# Altium project IPG.PrjPcb (part 4 of 13)

## Sheet 09-IMC.SchDoc: Impedance Measurement Circuit
size A2; DocumentNumber: 9; SheetNumber: 9; SheetTotal: 15
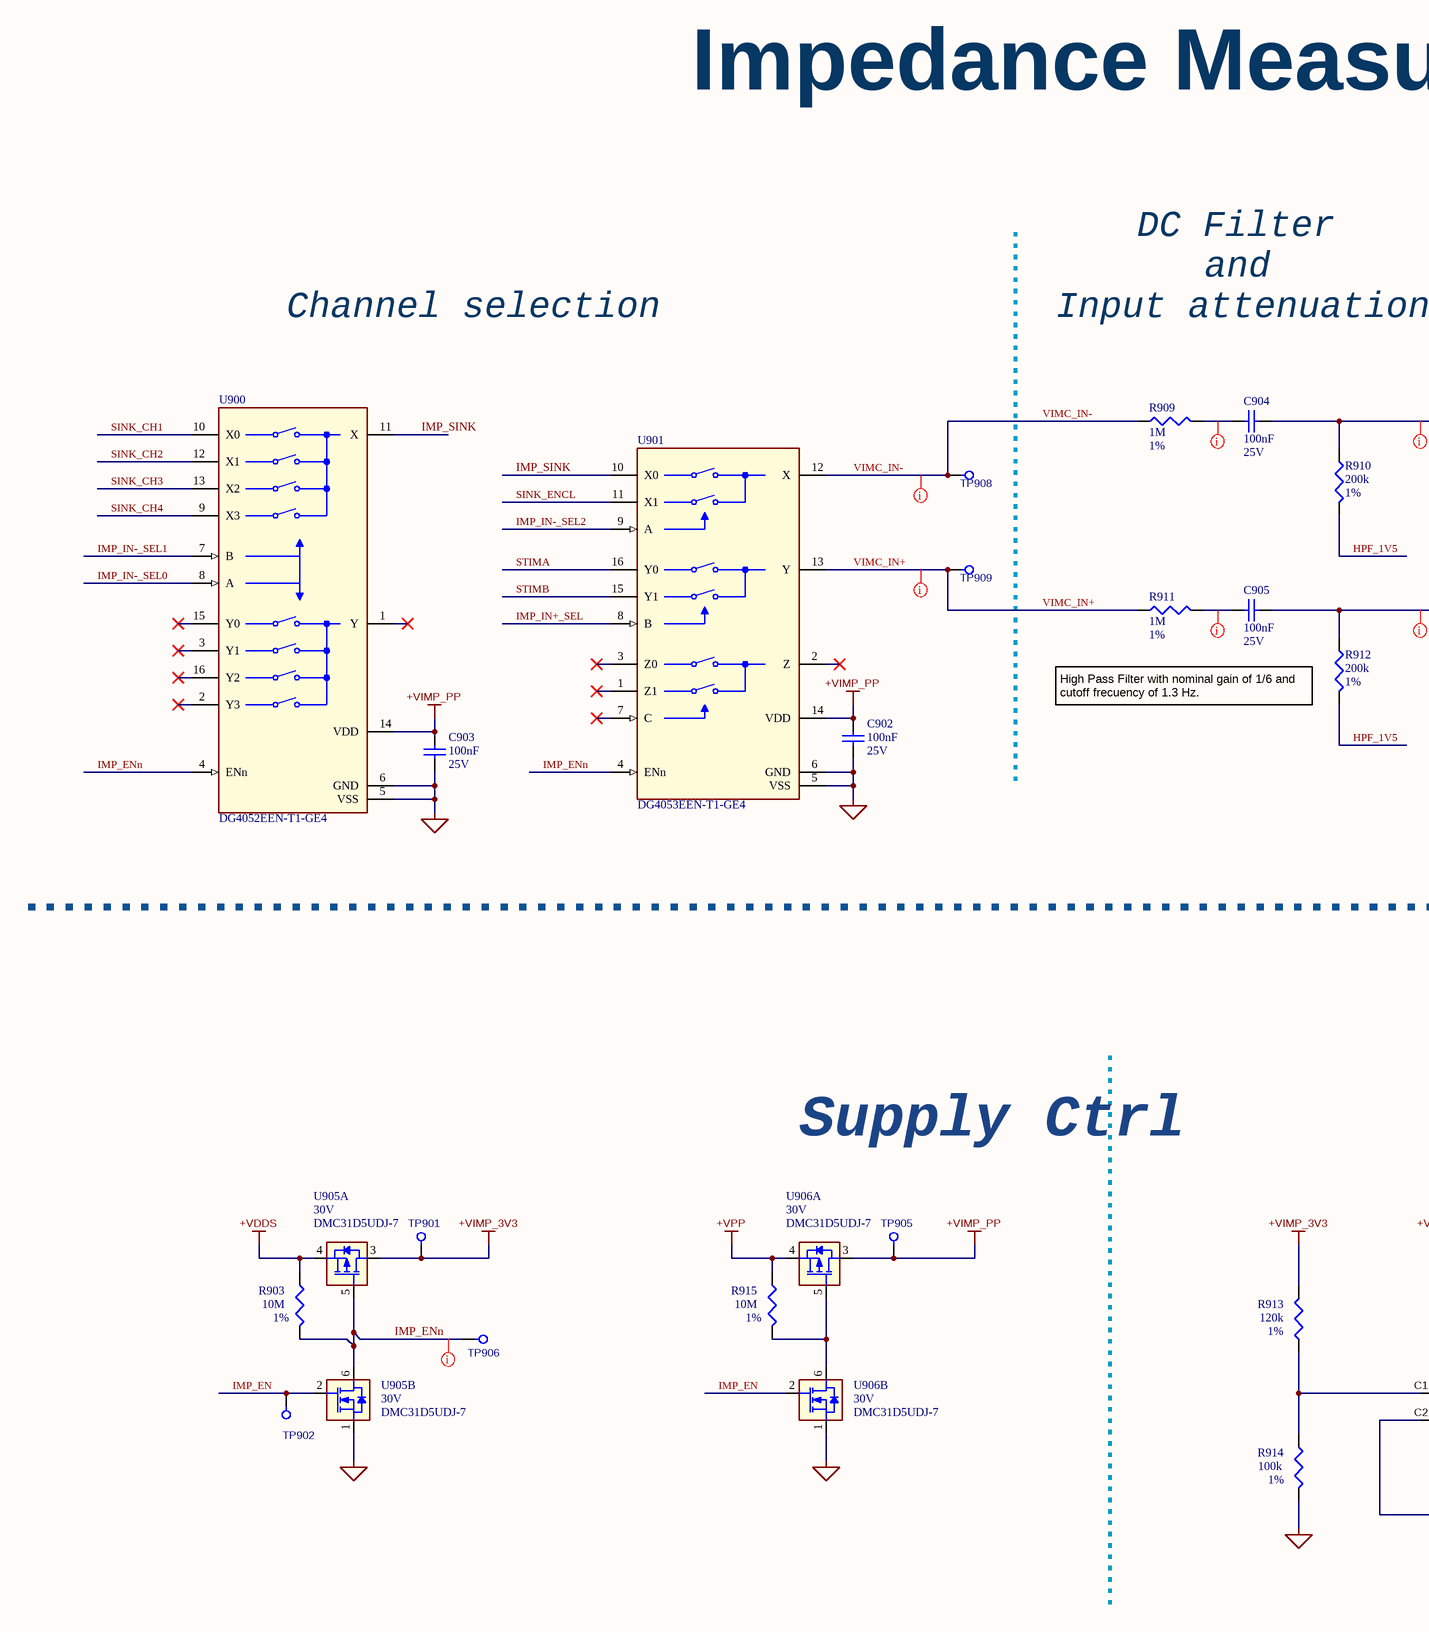
[diagram p12: 09-IMC.SchDoc, left]
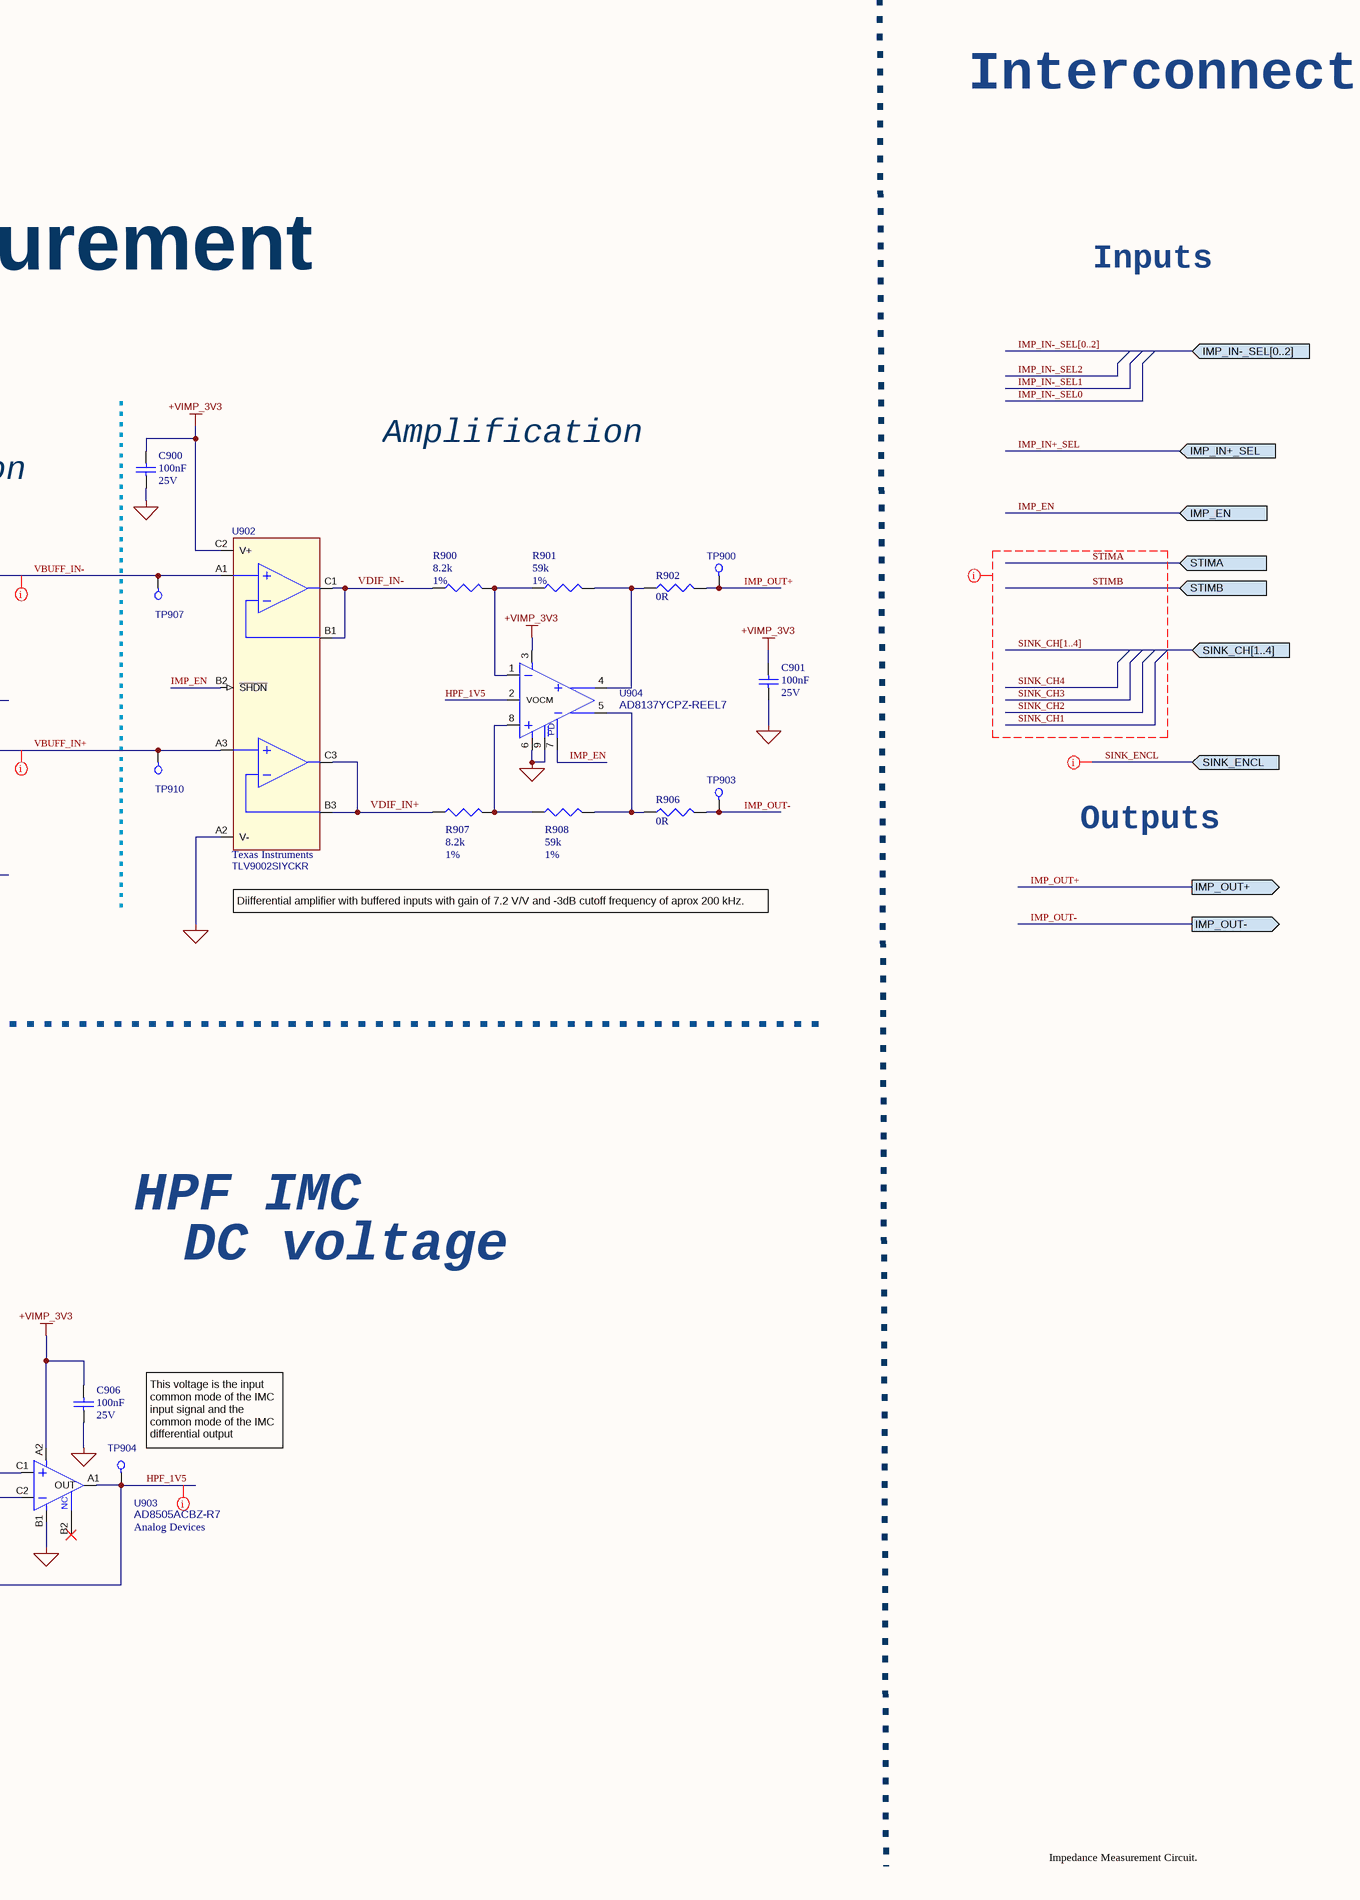
[diagram p13: 09-IMC.SchDoc, right]

### Parts
C900  value 100nF  Rated DC Voltage (URdc): 25V  [C0201_C]  (hidden comment: GRM033R61E104KE14J)
C901  value 100nF  Rated DC Voltage (URdc): 25V  [C0201_C]  (hidden comment: GRM033R61E104KE14J)
C902  value 100nF  Rated DC Voltage (URdc): 25V  [C0201_C]  (hidden comment: GRM033R61E104KE14J)
C903  value 100nF  Rated DC Voltage (URdc): 25V  [C0201_C]  (hidden comment: GRM033R61E104KE14J)
C904  value 100nF  Rated DC Voltage (URdc): 25V  [C0201_C]  (hidden comment: GRM033R61E104KE14J)
C905  value 100nF  Rated DC Voltage (URdc): 25V  [C0201_C]  (hidden comment: GRM033R61E104KE14J)
C906  value 100nF  Rated DC Voltage (URdc): 25V  [C0201_C]  (hidden comment: GRM033R61E104KE14J)
R900  value 8.2k  Tolerance: 1%  [R0201_C]  (hidden comment: CRCW02018K20FNED)
R901  value 59k  Tolerance: 1%  [R0201_C]  (hidden comment: CRCW020159K0FNED)
R902  value 0R  [R0201_C]  (hidden comment: CRCW02010000Z0ED)
R903  value 10M  Tolerance: 1%  [R0201_C]  (hidden comment: CRCW020110M0FNED)
R906  value 0R  [R0201_C]  (hidden comment: CRCW02010000Z0ED)
R907  value 8.2k  Tolerance: 1%  [R0201_C]  (hidden comment: CRCW02018K20FNED)
R908  value 59k  Tolerance: 1%  [R0201_C]  (hidden comment: CRCW020159K0FNED)
R909  value 1M  Tolerance: 1%  [R0201_C]  (hidden comment: CRCW02011M00FNED)
R910  value 200k  Tolerance: 1%  [R0201_C]  (hidden comment: CRCW0201200KFNED)
R911  value 1M  Tolerance: 1%  [R0201_C]  (hidden comment: CRCW02011M00FNED)
R912  value 200k  Tolerance: 1%  [R0201_C]  (hidden comment: CRCW0201200KFNED)
R913  value 120k  Tolerance: 1%  [R0201_C]  (hidden comment: CRCW0201120KFNED)
R914  value 100k  Tolerance: 1%  [R0201_C]  (hidden comment: CRCW0201100KFNED)
R915  value 10M  Tolerance: 1%  [R0201_C]  (hidden comment: CRCW020110M0FNED)
TP900  Test Point  [testpad_0.9mm]  (value not drawn)  (no BOM)
TP901  Test Point  [testpad_0.9mm]  (value not drawn)  (no BOM)
TP902  Test Point  [testpad_0.9mm]  (value not drawn)  (no BOM)
TP903  Test Point  [testpad_0.9mm]  (value not drawn)  (no BOM)
TP904  Test Point  [testpad_0.9mm]  (value not drawn)  (no BOM)
TP905  Test Point  [testpad_0.9mm]  (value not drawn)  (no BOM)
TP906  Test Point  [testpad_0.9mm]  (value not drawn)  (no BOM)
TP907  Test Point  [testpad_0.9mm]  (value not drawn)  (no BOM)
TP908  Test Point  [testpad_0.9mm]  (value not drawn)  (no BOM)
TP909  Test Point  [testpad_0.9mm]  (value not drawn)  (no BOM)
TP910  Test Point  [testpad_0.9mm]  (value not drawn)  (no BOM)
U900  DG4052EEN-T1-GE4  [QFN40P180X260X60-16N-D]
U901  DG4053EEN-T1-GE4  [QFN40P180X260X60-16N-D]
U902  Manufacturer: Texas Instruments  [TI_YCK0009]  (hidden comment: TLV9002SIYCKR)
U903  Manufacturer: Analog Devices  [AD8505ACBZ-R7]  (hidden comment: AD8505ACBZ-R7)
U904  AD8137YCPZ-REEL7  [AD_CP-8-13]
U905  DMC31D5UDJ-7  Vds(Max): 30V  [DIODESINC_SOT-963-6]  (parts A,B of 2)
U906  DMC31D5UDJ-7  Vds(Max): 30V  [DIODESINC_SOT-963-6]  (parts A,B of 2)

### Ports
IMP_EN (in), IMP_IN+_SEL (in), IMP_IN-_SEL[0..2] (in), IMP_OUT+ (out), IMP_OUT- (out), SINK_CH[1..4] (in), SINK_ENCL (in), STIMA (in), STIMB (in)

### Nets
+VDDS: R903.1 U905.4
+VIMP_3V3: C900.2 C901.2 C906.2 R913.2 TP901.1 U902.C2(V+) U903.A2(V+) U904.3(VS+) U905.3
+VIMP_PP: C902.2 C903.2 TP905.1 U900.14(VDD) U901.14(VDD) U906.3
+VPP: R915.1 U906.4
GND: C900.1 C901.1 C902.1 C903.1 C906.1 R914.2 U900.5(VSS) U900.6(GND) U901.5(VSS) U901.6(GND) U902.A2(V-) U903.B1(V-) U904.6(VS-) U904.9(EP) U905.1 U906.1
HPF_1V5: R910.1 R912.1 TP904.1 U903.A1(OUT) U903.C2(IN-) U904.2(VOCM)
IMP_EN: TP902.1 U902.B2(~{SHDN}) U904.7(~{PD}) U905.2 U906.2 ; port IMP_EN
IMP_ENn: R903.2 TP906.1 U900.4(ENn) U901.4(ENn) U905.5 U905.6
IMP_IN+_SEL: U901.8(B) ; port IMP_IN+_SEL
IMP_IN-_SEL0: U900.8(A)
IMP_IN-_SEL1: U900.7(B)
IMP_IN-_SEL2: U901.9(A)
IMP_OUT+: R902.2 TP900.1 ; port IMP_OUT+
IMP_OUT-: R906.2 TP903.1 ; port IMP_OUT-
IMP_SINK: U900.11(X) U901.10(X0)
SINK_CH1: U900.10(X0)
SINK_CH2: U900.12(X1)
SINK_CH3: U900.13(X2)
SINK_CH4: U900.9(X3)
SINK_ENCL: U901.11(X1) ; port SINK_ENCL
STIMA: U901.16(Y0) ; port STIMA
STIMB: U901.15(Y1) ; port STIMB
VBUFF_IN+: C905.1 R912.2 TP910.1 U902.A3(IN2+)
VBUFF_IN-: C904.1 R910.2 TP907.1 U902.A1(IN1+)
VDIF_IN+: R907.1 U902.B3(IN2-) U902.C3(OUT2)
VDIF_IN-: R900.1 U902.B1(IN1-) U902.C1(OUT1)
VIMC_IN+: R911.2 TP909.1 U901.13(Y)
VIMC_IN-: R909.2 TP908.1 U901.12(X)
NetC904_2: C904.2 R909.1
NetC905_2: C905.2 R911.1
NetR900_2: R900.2 R901.1 U904.1(-IN)
NetR901_2: R901.2 R902.1 U904.4(+OUT)
NetR906_1: R906.1 R908.2 U904.5(-OUT)
NetR907_2: R907.2 R908.1 U904.8(+IN)
NetR913_1: R913.1 R914.1 U903.C1(IN+)
NetR915_2: R915.2 U906.5 U906.6

Not connected (* = marked no-connect by the designer): U900 1(Y)* 2(Y3)* 3(Y1)* 15(Y0)* 16(Y2)*; U901 1(Z1)* 2(Z)* 3(Z0)* 7(C)*; U903 B2(NC)*

### Buses and harness runs
bus IMP_IN-_SEL[0..2] = port IMP_IN-_SEL[0..2]
bus SINK_CH[1..4] = port SINK_CH[1..4]

### Layout directives
net class ANALOG: HPF_1V5, NetC904_2, NetC905_2, SINK_CH1, SINK_CH2, SINK_CH3, SINK_CH4, SINK_CH[1..4], SINK_ENCL, STIMA, STIMB, VBUFF_IN+, VBUFF_IN-, VIMC_IN+, VIMC_IN-
net class DIGITAL: IMP_ENn

### Notes on the sheet
- Interconnect
- Impedance Measurement
- Inputs
- DC Filter
- Channel selection
- Input attenuation
- and
- Amplification
- (near R912) High Pass Filter with nominal gain of 1/6 and cutoff frecuency of 1.3 Hz.
- Outputs
- Diifferential amplifier with buffered inputs with gain of 7.2 V/V and -3dB cutoff frequency of aprox 200 kHz.
- Supply Ctrl
- HPF IMC
- DC voltage
- (near TP904) This voltage is the input common mode of the IMC input signal and the common mode of the IMC differential output
- Impedance Measurement Circuit.
- Project:
- Schematic:
- Design by:
- Date:
- Ver:
- .
- Comments:
- Reviewed by:
- (in symbol AD8137YCPZ-REEL7) PD

### Library data of the parts
C900-C906 = GRM033R61E104KE14J: Ceramic Capacitor, Multilayer, Ceramic, 25V, 10% +Tol, 10% -Tol, X5R, 15% TC, 0.1uF, Surface Mount, 0201; Manufacturer: Murata; Multilayer: Yes; Category: Ceramic Capacitors; Supplier: Digikey; Supplier Part Number: 490-14571-1-ND; Manufacturer Part Number: GRM033R61E104KE14J; RoHS: Yes; Stock: 1540851; Pricing: 1=0,1, 10=0,033, 50=0,0192, 100=0,0148, 500=0,01118, 1000=0,00878, 2500=0,00798, 5000=0,00734 (USD); Mounting Technology: Surface Mount; Pins: 2; Dielectric Material: Ceramic; Package Shape: Rectangular; Case/Package: 0201; Terminal Finish: Nickel; Min Operating Temperature: -55°C; Max Operating Temperature: 85°C; JESD-609 Code: e3; Capacitor Type: Ceramic; Tolerance  (fill in as +-): 10%; Package Style: SMTMeter; Packaging: Tape and Reel; Tolerance (fill in as +-): 10%; Temperature Characteristics Code: X5R; Termination: Wraparound; Length: 0.6mm; Width: 0.3mm; Height: 0.3mm; Reach SVHC Compliant: Yes; RoHS Compliant: Yes; ComponentLink1URL: https://psearch.en.murata.com:443/capacitor/product/GRM033R61E104KE14%23.pdf?src-supplier=IHS+Markit; ComponentLink1Description: https://psearch.en.murata.com:443/capacitor/product/GRM033R61E104KE14%23.pdf?src-supplier=IHS+Markit; ComponentLink2URL: http://www.mouser.com/ds/2/281/c02e-2905.pdf?src-supplier=Mouser; ComponentLink2Description: http://www.mouser.com/ds/2/281/c02e-2905.pdf?src-supplier=Mouser; ComponentLink3URL: http://search.murata.co.jp/Ceramy/image/img/A01X/G101/ENG/GRM033R61E104KE14-01.pdf?src-supplier=Digikey; ComponentLink3Description: http://search.murata.co.jp/Ceramy/image/img/A01X/G101/ENG/GRM033R61E104KE14-01.pdf?src-supplier=Digikey; ComponentLink4URL: https://search.murata.co.jp/Ceramy/image/img/A01X/G101/ENG/GRM033R61E104KE14-01.pdf?src-supplier=Digikey; ComponentLink4Description: https://search.murata.co.jp/Ceramy/image/img/A01X/G101/ENG/GRM033R61E104KE14-01.pdf?src-supplier=Digikey; Supplier 1: Arrow Electronics; Supplier Part Number 1: GRM033R61E104KE14J
R900 R907 = CRCW02018K20FNED: Fixed Resistor, Metal Glaze/thick Film, 0.05W, 8200ohm, 30V, 1% +/-Tol, 200ppm/Cel, Surface Mount, 0201; Manufacturer: Vishay; Medical Grade MFR: TBD; Power: 50mW; Rated Temperature: 70°C; Temperature Coefficient: 200ppm/°C; Package Height: 0.23mm; Package Length: 0.6mm; Package Width: 0.3mm; Reference Standard: AEC-Q200; Manufacturer Part Number: CRCW02018K20FNED; RoHS: Yes; Category: Chip SMD Resistors; Mounting Technology: Surface Mount; Pins: 2; Package Shape: Rectangular; Case/Package: 0201; Terminal Finish: Nickel; Min Operating Temperature: -55°C; Max Operating Temperature: 155°C; Resistor Type: FIXED RESISTOR; Construction: Chip; Package Style: SMTMeter; Technology: METAL GLAZE/THICK FILM; Termination: Wraparound; Working Voltage: 30V; Reach SVHC Compliant: Yes; RoHS Compliant: Yes; ComponentLink1URL: https://datasheet.ciiva.com:443/pdfs/VipMasterIC/IC/VISH/VISH-S-A0002932828/VISH-S-A0002932828-1.pdf?src-supplier=IHS+Markit; ComponentLink1Description: https://datasheet.ciiva.com:443/pdfs/VipMasterIC/IC/VISH/VISH-S-A0002932828/VISH-S-A0002932828-1.pdf?src-supplier=IHS+Markit; ComponentLink2URL: https://datasheet.ciiva.com/7983/1719906-7983324.pdf?src-supplier=Element14; ComponentLink2Description: https://datasheet.ciiva.com/7983/1719906-7983324.pdf?src-supplier=Element14; ComponentLink3URL: https://datasheet.ciiva.com/7983/1719906-7983323.pdf?src-supplier=Element14; ComponentLink3Description: https://datasheet.ciiva.com/7983/1719906-7983323.pdf?src-supplier=Element14; ComponentLink4URL: https://datasheet.ciiva.com/22692/1719906-22692751.pdf?src-supplier=Element14; ComponentLink4Description: https://datasheet.ciiva.com/22692/1719906-22692751.pdf?src-supplier=Element14; ComponentLink5URL: https://datasheet.ciiva.com/22665/1825492-22665818.pdf?src-supplier=Element14; ComponentLink5Description: https://datasheet.ciiva.com/22665/1825492-22665818.pdf?src-supplier=Element14; ComponentLink6URL: https://datasheet.ciiva.com/2474/crcw0201e3-2474801.pdf?src-supplier=Digikey; ComponentLink6Description: https://datasheet.ciiva.com/2474/crcw0201e3-2474801.pdf?src-supplier=Digikey; ComponentLink7URL: https://datasheet.ciiva.com/2474/crcw0201e3-2474802.pdf?src-supplier=Digikey; ComponentLink7Description: https://datasheet.ciiva.com/2474/crcw0201e3-2474802.pdf?src-supplier=Digikey; ComponentLink8URL: https://datasheet.ciiva.com/2474/crcw0201e3-2474800.pdf?src-supplier=Digikey; ComponentLink8Description: https://datasheet.ciiva.com/2474/crcw0201e3-2474800.pdf?src-supplier=Digikey; ComponentLink9URL: https://datasheet.ciiva.com/22871/70202042-22871422.pdf?src-supplier=Allied+Electronics; ComponentLink9Description: https://datasheet.ciiva.com/22871/70202042-22871422.pdf?src-supplier=Allied+Electronics; ComponentLink10URL: https://datasheet.ciiva.com/3255/crcw0201e3-3255929.pdf?src-supplier=Avnet; ComponentLink10Description: https://datasheet.ciiva.com/3255/crcw0201e3-3255929.pdf?src-supplier=Avnet; Medical Grade MFR PN: TBD; Supplier 1: Digikey; Supplier Part Number 1: 541-CRCW02018K20FNEDCT-ND
R901 R908 = CRCW020159K0FNED: Fixed Resistor, Metal Glaze/thick Film, 0.05W, 59000ohm, 30V, 1% +/-Tol, 200ppm/Cel, Surface Mount, 0201; Manufacturer: Vishay; Medical Grade MFR: TBD; Power: 50mW; Rated Temperature: 70°C; Temperature Coefficient: 200ppm/°C; Package Height: 0.23mm; Package Length: 0.6mm; Package Width: 0.3mm; Reference Standard: AEC-Q200; Manufacturer Part Number: CRCW020159K0FNED; RoHS: Yes; Category: Chip SMD Resistors; Mounting Technology: Surface Mount; Pins: 2; Package Shape: Rectangular; Case/Package: 0201; Terminal Finish: Nickel; Min Operating Temperature: -55°C; Max Operating Temperature: 155°C; Resistor Type: FIXED RESISTOR; Construction: Chip; Package Style: SMTMeter; Technology: METAL GLAZE/THICK FILM; Termination: Wraparound; Working Voltage: 30V; Reach SVHC Compliant: Yes; RoHS Compliant: Yes; ComponentLink1URL: https://datasheet.ciiva.com:443/pdfs/VipMasterIC/IC/VISH/VISH-S-A0002932828/VISH-S-A0002932828-1.pdf?src-supplier=IHS+Markit; ComponentLink1Description: https://datasheet.ciiva.com:443/pdfs/VipMasterIC/IC/VISH/VISH-S-A0002932828/VISH-S-A0002932828-1.pdf?src-supplier=IHS+Markit; ComponentLink2URL: https://datasheet.ciiva.com/7983/1719906-7983324.pdf?src-supplier=Element14; ComponentLink2Description: https://datasheet.ciiva.com/7983/1719906-7983324.pdf?src-supplier=Element14; ComponentLink3URL: https://datasheet.ciiva.com/7983/1719906-7983323.pdf?src-supplier=Element14; ComponentLink3Description: https://datasheet.ciiva.com/7983/1719906-7983323.pdf?src-supplier=Element14; ComponentLink4URL: https://datasheet.ciiva.com/22692/1719906-22692751.pdf?src-supplier=Element14; ComponentLink4Description: https://datasheet.ciiva.com/22692/1719906-22692751.pdf?src-supplier=Element14; ComponentLink5URL: https://datasheet.ciiva.com/22665/1825492-22665818.pdf?src-supplier=Element14; ComponentLink5Description: https://datasheet.ciiva.com/22665/1825492-22665818.pdf?src-supplier=Element14; ComponentLink6URL: https://datasheet.ciiva.com/2474/crcw0201e3-2474801.pdf?src-supplier=Digikey; ComponentLink6Description: https://datasheet.ciiva.com/2474/crcw0201e3-2474801.pdf?src-supplier=Digikey; ComponentLink7URL: https://datasheet.ciiva.com/2474/crcw0201e3-2474802.pdf?src-supplier=Digikey; ComponentLink7Description: https://datasheet.ciiva.com/2474/crcw0201e3-2474802.pdf?src-supplier=Digikey; ComponentLink8URL: https://datasheet.ciiva.com/2474/crcw0201e3-2474800.pdf?src-supplier=Digikey; ComponentLink8Description: https://datasheet.ciiva.com/2474/crcw0201e3-2474800.pdf?src-supplier=Digikey; ComponentLink9URL: https://datasheet.ciiva.com/22871/70202042-22871422.pdf?src-supplier=Allied+Electronics; ComponentLink9Description: https://datasheet.ciiva.com/22871/70202042-22871422.pdf?src-supplier=Allied+Electronics; ComponentLink10URL: https://datasheet.ciiva.com/3255/crcw0201e3-3255929.pdf?src-supplier=Avnet; ComponentLink10Description: https://datasheet.ciiva.com/3255/crcw0201e3-3255929.pdf?src-supplier=Avnet; Medical Grade MFR PN: TBD; Supplier 1: Digikey; Supplier Part Number 1: 541-CRCW020159K0FNEDCT-ND
R902 R906 = CRCW02010000Z0ED: Fixed Resistor, Metal Glaze/thick Film, 0.05W, 0ohm, Surface Mount, 0201; Manufacturer: Vishay; Medical Grade MFR: Mini-Systems; Medical Grade MFR PN: MWA96SM-0000F-NS62TR; Power: 50mW; Rated Temperature: 70°C; Package Height: 0.23mm; Package Length: 0.6mm; Package Width: 0.3mm; Reference Standard: AEC-Q200; Category: Chip SMD Resistors; Supplier: Digikey; Supplier Part Number: 541-0.0AGCT-ND; Manufacturer Part Number: CRCW02010000Z0ED; RoHS: Yes; Stock: 701366; Pricing: 1=0,1, 10=0,034, 25=0,026, 50=0,0198, 100=0,0138, 250=0,01112, 500=0,0089, 1000=0,00655, 5000=0,0047 (USD); Mounting Technology: Surface Mount; Pins: 2; Package Shape: Rectangular; Case/Package: 0201; Terminal Finish: Nickel; Min Operating Temperature: -55°C; Max Operating Temperature: 155°C; JESD-609 Code: e3; Resistor Type: FIXED RESISTOR; Construction: Chip; Package Style: SMTMeter; Packaging: Tape and Reel; Technology: METAL GLAZE/THICK FILM; Termination: Wraparound; Reach SVHC Compliant: Yes; RoHS Compliant: Yes; ComponentLink1URL: https://datasheet.ciiva.com:443/pdfs/VipMasterIC/IC/VISH/VISH-S-A0002932828/VISH-S-A0002932828-1.pdf?src-supplier=IHS+Markit; ComponentLink1Description: https://datasheet.ciiva.com:443/pdfs/VipMasterIC/IC/VISH/VISH-S-A0002932828/VISH-S-A0002932828-1.pdf?src-supplier=IHS+Markit; ComponentLink2URL: https://datasheet.ciiva.com/2471/crcw0201e3-2471712.pdf?src-supplier=Digikey; ComponentLink2Description: https://datasheet.ciiva.com/2471/crcw0201e3-2471712.pdf?src-supplier=Digikey; ComponentLink3URL: https://datasheet.ciiva.com/7841/1719906-7841431.pdf?src-supplier=Element14; ComponentLink3Description: https://datasheet.ciiva.com/7841/1719906-7841431.pdf?src-supplier=Element14; ComponentLink4URL: https://datasheet.ciiva.com/7841/1719906-7841430.pdf?src-supplier=Element14; ComponentLink4Description: https://datasheet.ciiva.com/7841/1719906-7841430.pdf?src-supplier=Element14; ComponentLink5URL: https://datasheet.ciiva.com/22665/1847332-22665688.pdf?src-supplier=Element14; ComponentLink5Description: https://datasheet.ciiva.com/22665/1847332-22665688.pdf?src-supplier=Element14; ComponentLink6URL: https://datasheet.ciiva.com/2471/crcw0201e3-2471713.pdf?src-supplier=Digikey; ComponentLink6Description: https://datasheet.ciiva.com/2471/crcw0201e3-2471713.pdf?src-supplier=Digikey; ComponentLink7URL: https://datasheet.ciiva.com/2471/crcw0201e3-2471711.pdf?src-supplier=Digikey; ComponentLink7Description: https://datasheet.ciiva.com/2471/crcw0201e3-2471711.pdf?src-supplier=Digikey; ComponentLink8URL: https://datasheet.ciiva.com/16757/70202042-16757849.pdf?src-supplier=Allied+Electronics; ComponentLink8Description: https://datasheet.ciiva.com/16757/70202042-16757849.pdf?src-supplier=Allied+Electronics; ComponentLink9URL: https://datasheet.ciiva.com/16436/crcw0201e3-16436237.pdf?src-supplier=Future+Electronics; ComponentLink9Description: https://datasheet.ciiva.com/16436/crcw0201e3-16436237.pdf?src-supplier=Future+Electronics; Supplier 1: Digikey; Supplier Part Number 1: 541-0.0AGDKR-ND
R903 R915 = CRCW020110M0FNED: Fixed Resistor, Metal Glaze/thick Film, 0.05W, 10000000ohm, 30V, 1% +/-Tol, 200ppm/Cel, Surface Mount, 0201; Manufacturer: Vishay Draloric; Medical Grade MFR: Mini-Systems; Medical Grade MFR PN: MWA96SM-1005F-NS62TR; Power: 50mW; Rated Temperature: 70°C; Temperature Coefficient: 200ppm/°C; Category: Chip SMD Resistors; Supplier: Mouser; Supplier Part Number: 71-CRCW020110M0FNED; Manufacturer Part Number: CRCW020110M0FNED; RoHS: Yes; Stock: 159754; Pricing: 1=0,1, 10=0,024, 50=0,024, 100=0,014, 1000=0,011, 10000=0,006 (USD); Mounting Technology: Surface Mount; Pins: 2; Package Shape: Rectangular; Case/Package: 0201; Terminal Finish: Nickel; Min Operating Temperature: -55°C; Max Operating Temperature: 155°C; JESD-609 Code: e3; Resistor Type: FIXED RESISTOR; Packaging: Tape and Reel; Technology: METAL GLAZE/THICK FILM; Termination: Wraparound; Working Voltage: 30V; Reach SVHC Compliant: Yes; RoHS Compliant: Yes; ComponentLink1URL: https://datasheet.ciiva.com:443/pdfs/VipMasterIC/IC/VISH/VISH-S-A0002932828/VISH-S-A0002932828-1.pdf?src-supplier=IHS+Markit; ComponentLink1Description: https://datasheet.ciiva.com:443/pdfs/VipMasterIC/IC/VISH/VISH-S-A0002932828/VISH-S-A0002932828-1.pdf?src-supplier=IHS+Markit; ComponentLink2URL: https://datasheet.ciiva.com/7673/1719906-7673177.pdf?src-supplier=Element14; ComponentLink2Description: https://datasheet.ciiva.com/7673/1719906-7673177.pdf?src-supplier=Element14; ComponentLink3URL: https://datasheet.ciiva.com/7673/1719906-7673178.pdf?src-supplier=Element14; ComponentLink3Description: https://datasheet.ciiva.com/7673/1719906-7673178.pdf?src-supplier=Element14; ComponentLink4URL: https://datasheet.ciiva.com/22692/1719906-22692711.pdf?src-supplier=Element14; ComponentLink4Description: https://datasheet.ciiva.com/22692/1719906-22692711.pdf?src-supplier=Element14; ComponentLink5URL: https://datasheet.ciiva.com/22665/1700795-22665701.pdf?src-supplier=Element14; ComponentLink5Description: https://datasheet.ciiva.com/22665/1700795-22665701.pdf?src-supplier=Element14; Supplier 1: Digikey; Supplier Part Number 1: 541-CRCW020110M0FNEDCT-ND
R909 R911 = CRCW02011M00FNED: Fixed Resistor, Metal Glaze/thick Film, 0.05W, 1000000ohm, 30V, 1% +/-Tol, 200ppm/Cel, Surface Mount, 0201; Manufacturer: Vishay; Medical Grade MFR: Mini-Systems; Medical Grade MFR PN: MWA96SM-1004F-NS62TR; Power: 50mW; Rated Temperature: 70°C; Temperature Coefficient: 200ppm/°C; Package Height: 0.23mm; Package Length: 0.6mm; Package Width: 0.3mm; Reference Standard: AEC-Q200; Supplier: Digikey; Supplier Part Number: 541-1.00MABCT-ND; Manufacturer Part Number: CRCW02011M00FNED; RoHS: Yes; Category: Chip SMD Resistors; Stock: 392914; Pricing: 1=0,1, 10=0,037, 50=0,0242, 100=0,0204, 500=0,01426, 1000=0,01241, 5000=0,00924 (USD); Mounting Technology: Surface Mount; Pins: 2; Package Shape: Rectangular; Case/Package: 0201; Terminal Finish: Nickel; Min Operating Temperature: -55°C; Max Operating Temperature: 155°C; JESD-609 Code: e3; Resistor Type: FIXED RESISTOR; Construction: Chip; Package Style: SMTMeter; Packaging: Tape and Reel; Technology: METAL GLAZE/THICK FILM; Termination: Wraparound; Working Voltage: 30V; Reach SVHC Compliant: Yes; RoHS Compliant: Yes; ComponentLink1URL: https://datasheet.ciiva.com:443/pdfs/VipMasterIC/IC/VISH/VISH-S-A0002932828/VISH-S-A0002932828-1.pdf?src-supplier=IHS+Markit; ComponentLink1Description: https://datasheet.ciiva.com:443/pdfs/VipMasterIC/IC/VISH/VISH-S-A0002932828/VISH-S-A0002932828-1.pdf?src-supplier=IHS+Markit; ComponentLink2URL: https://datasheet.ciiva.com/7841/1719906-7841438.pdf?src-supplier=Element14; ComponentLink2Description: https://datasheet.ciiva.com/7841/1719906-7841438.pdf?src-supplier=Element14; ComponentLink3URL: https://datasheet.ciiva.com/7841/1719906-7841439.pdf?src-supplier=Element14; ComponentLink3Description: https://datasheet.ciiva.com/7841/1719906-7841439.pdf?src-supplier=Element14; ComponentLink4URL: https://datasheet.ciiva.com/7859/dcrcwe3-7859689.pdf?src-supplier=Element14; ComponentLink4Description: https://datasheet.ciiva.com/7859/dcrcwe3-7859689.pdf?src-supplier=Element14; ComponentLink5URL: https://datasheet.ciiva.com/16757/70202042-16757675.pdf?src-supplier=Allied+Electronics; ComponentLink5Description: https://datasheet.ciiva.com/16757/70202042-16757675.pdf?src-supplier=Allied+Electronics; ComponentLink6URL: https://datasheet.ciiva.com/22692/1719906-22692761.pdf?src-supplier=Element14; ComponentLink6Description: https://datasheet.ciiva.com/22692/1719906-22692761.pdf?src-supplier=Element14; ComponentLink7URL: https://datasheet.ciiva.com/9109/crcw0201e3-9109910.pdf?src-supplier=Avnet; ComponentLink7Description: https://datasheet.ciiva.com/9109/crcw0201e3-9109910.pdf?src-supplier=Avnet; ComponentLink8URL: https://datasheet.ciiva.com/22675/1847332-22675065.pdf?src-supplier=Element14; ComponentLink8Description: https://datasheet.ciiva.com/22675/1847332-22675065.pdf?src-supplier=Element14; ComponentLink9URL: https://datasheet.ciiva.com/2474/crcw0201e3-2474824.pdf?src-supplier=Digikey; ComponentLink9Description: https://datasheet.ciiva.com/2474/crcw0201e3-2474824.pdf?src-supplier=Digikey; ComponentLink10URL: https://datasheet.ciiva.com/2474/crcw0201e3-2474825.pdf?src-supplier=Digikey; ComponentLink10Description: https://datasheet.ciiva.com/2474/crcw0201e3-2474825.pdf?src-supplier=Digikey; ComponentLink11URL: https://datasheet.ciiva.com/2474/crcw0201e3-2474826.pdf?src-supplier=Digikey; ComponentLink11Description: https://datasheet.ciiva.com/2474/crcw0201e3-2474826.pdf?src-supplier=Digikey; Supplier 1: Digikey; Supplier Part Number 1: 541-1.00MABCT-ND
R910 R912 = CRCW0201200KFNED: Fixed Resistor, Metal Glaze/thick Film, 0.05W, 200000ohm, 30V, 1% +/-Tol, 200ppm/Cel, Surface Mount, 0201; Manufacturer: Vishay; Medical Grade MFR: TBD; Power: 50mW; Rated Temperature: 70°C; Temperature Coefficient: 200ppm/°C; Package Height: 0.23mm; Package Length: 0.6mm; Package Width: 0.3mm; Reference Standard: AEC-Q200; Supplier: Digikey; Supplier Part Number: 541-2945-1-ND; Manufacturer Part Number: CRCW0201200KFNED; RoHS: Yes; Category: Chip SMD Resistors; Stock: 43796; Pricing: 1=0,1, 10=0,037, 50=0,0242, 100=0,0204, 500=0,01426, 1000=0,01241, 5000=0,00924 (USD); Mounting Technology: Surface Mount; Pins: 2; Package Shape: Rectangular; Case/Package: 0201; Terminal Finish: Nickel; Min Operating Temperature: -55°C; Max Operating Temperature: 155°C; JESD-609 Code: e3; Resistor Type: FIXED RESISTOR; Construction: Chip; Package Style: SMTMeter; Packaging: Tape and Reel; Technology: METAL GLAZE/THICK FILM; Termination: Wraparound; Working Voltage: 30V; Reach SVHC Compliant: Yes; RoHS Compliant: Yes; ComponentLink1URL: https://datasheet.ciiva.com:443/pdfs/VipMasterIC/IC/VISH/VISH-S-A0002932828/VISH-S-A0002932828-1.pdf?src-supplier=IHS+Markit; ComponentLink1Description: https://datasheet.ciiva.com:443/pdfs/VipMasterIC/IC/VISH/VISH-S-A0002932828/VISH-S-A0002932828-1.pdf?src-supplier=IHS+Markit; ComponentLink2URL: https://datasheet.ciiva.com/7714/1719906-7714137.pdf?src-supplier=Element14; ComponentLink2Description: https://datasheet.ciiva.com/7714/1719906-7714137.pdf?src-supplier=Element14; ComponentLink3URL: https://datasheet.ciiva.com/7714/1719906-7714138.pdf?src-supplier=Element14; ComponentLink3Description: https://datasheet.ciiva.com/7714/1719906-7714138.pdf?src-supplier=Element14; ComponentLink4URL: https://datasheet.ciiva.com/2577/crcw0201e3-2577332.pdf?src-supplier=Digikey; ComponentLink4Description: https://datasheet.ciiva.com/2577/crcw0201e3-2577332.pdf?src-supplier=Digikey; ComponentLink5URL: https://datasheet.ciiva.com/8961/crcw0201e3-8961381.pdf?src-supplier=Avnet; ComponentLink5Description: https://datasheet.ciiva.com/8961/crcw0201e3-8961381.pdf?src-supplier=Avnet; ComponentLink6URL: https://datasheet.ciiva.com/22675/1700795-22675066.pdf?src-supplier=Element14; ComponentLink6Description: https://datasheet.ciiva.com/22675/1700795-22675066.pdf?src-supplier=Element14; ComponentLink7URL: https://datasheet.ciiva.com/22692/1719906-22692766.pdf?src-supplier=Element14; ComponentLink7Description: https://datasheet.ciiva.com/22692/1719906-22692766.pdf?src-supplier=Element14; Medical Grade MFR PN: TBD; Supplier 1: Digikey; Supplier Part Number 1: 541-2945-1-ND
R913 = CRCW0201120KFNED: Fixed Resistor, Metal Glaze/thick Film, 0.05W, 120000ohm, 30V, 1% +/-Tol, 200ppm/Cel, Surface Mount, 0201; Manufacturer: Vishay Dale; Medical Grade MFR: TBD; Power: 50mW; Rated Temperature: 70°C; Temperature Coefficient: 200ppm/°C; Manufacturer Part Number: CRCW0201120KFNED; RoHS: Yes; Category: Chip SMD Resistors; Mounting Technology: Surface Mount; Pins: 2; Package Shape: Rectangular; Case/Package: 0201; Terminal Finish: Nickel; Min Operating Temperature: -55°C; Max Operating Temperature: 155°C; Resistor Type: FIXED RESISTOR; Technology: METAL GLAZE/THICK FILM; Termination: Wraparound; Working Voltage: 30V; Reach SVHC Compliant: Yes; RoHS Compliant: Yes; ComponentLink1URL: https://datasheet.ciiva.com:443/pdfs/VipMasterIC/IC/VISH/VISH-S-A0002932828/VISH-S-A0002932828-1.pdf?src-supplier=IHS+Markit; ComponentLink1Description: https://datasheet.ciiva.com:443/pdfs/VipMasterIC/IC/VISH/VISH-S-A0002932828/VISH-S-A0002932828-1.pdf?src-supplier=IHS+Markit; ComponentLink2URL: https://datasheet.ciiva.com/7800/1719906-7800943.pdf?src-supplier=Element14; ComponentLink2Description: https://datasheet.ciiva.com/7800/1719906-7800943.pdf?src-supplier=Element14; ComponentLink3URL: https://datasheet.ciiva.com/22682/1700795-22682622.pdf?src-supplier=Element14; ComponentLink3Description: https://datasheet.ciiva.com/22682/1700795-22682622.pdf?src-supplier=Element14; ComponentLink4URL: https://datasheet.ciiva.com/22702/1719906-22702669.pdf?src-supplier=Element14; ComponentLink4Description: https://datasheet.ciiva.com/22702/1719906-22702669.pdf?src-supplier=Element14; ComponentLink5URL: https://datasheet.ciiva.com/29926/crcw0201e3-29926006.pdf?src-supplier=Avnet; ComponentLink5Description: https://datasheet.ciiva.com/29926/crcw0201e3-29926006.pdf?src-supplier=Avnet; Medical Grade MFR PN: TBD; Supplier 1: Digikey; Supplier Part Number 1: 541-CRCW0201120KFNEDDKR-ND
R914 = CRCW0201100KFNED: Fixed Resistor, Metal Glaze/thick Film, 0.05W, 100000ohm, 30V, 1% +/-Tol, 200ppm/Cel, Surface Mount, 0201; Manufacturer: Vishay; Medical Grade MFR: Mini-Systems; Medical Grade MFR PN: MWA96SM-1003F-NS62TR; Power: 50mW; Rated Temperature: 70°C; Temperature Coefficient: 200ppm/°C; Package Height: 0.23mm; Package Length: 0.6mm; Package Width: 0.3mm; Reference Standard: AEC-Q200; Category: Chip SMD Resistors; Supplier: Digikey; Supplier Part Number: 541-100KABCT-ND; Manufacturer Part Number: CRCW0201100KFNED; RoHS: Yes; Stock: 8252; Pricing: 1=0,1, 10=0,037, 50=0,0242, 100=0,0204, 500=0,01426, 1000=0,01241, 5000=0,00924 (USD); Mounting Technology: Surface Mount; Pins: 2; Package Shape: Rectangular; Case/Package: 0201; Terminal Finish: Nickel; Min Operating Temperature: -55°C; Max Operating Temperature: 155°C; JESD-609 Code: e3; Resistor Type: FIXED RESISTOR; Construction: Chip; Package Style: SMTMeter; Packaging: Tape and Reel; Technology: METAL GLAZE/THICK FILM; Termination: Wraparound; Working Voltage: 30V; Reach SVHC Compliant: Yes; RoHS Compliant: Yes; ComponentLink1URL: https://datasheet.ciiva.com:443/pdfs/VipMasterIC/IC/VISH/VISH-S-A0002932828/VISH-S-A0002932828-1.pdf?src-supplier=IHS+Markit; ComponentLink1Description: https://datasheet.ciiva.com:443/pdfs/VipMasterIC/IC/VISH/VISH-S-A0002932828/VISH-S-A0002932828-1.pdf?src-supplier=IHS+Markit; ComponentLink2URL: https://datasheet.ciiva.com/2474/crcw0201e3-2474797.pdf?src-supplier=Digikey; ComponentLink2Description: https://datasheet.ciiva.com/2474/crcw0201e3-2474797.pdf?src-supplier=Digikey; ComponentLink3URL: https://datasheet.ciiva.com/2474/crcw0201e3-2474798.pdf?src-supplier=Digikey; ComponentLink3Description: https://datasheet.ciiva.com/2474/crcw0201e3-2474798.pdf?src-supplier=Digikey; ComponentLink4URL: https://datasheet.ciiva.com/2474/crcw0201e3-2474799.pdf?src-supplier=Digikey; ComponentLink4Description: https://datasheet.ciiva.com/2474/crcw0201e3-2474799.pdf?src-supplier=Digikey; ComponentLink5URL: https://datasheet.ciiva.com/16436/dcrcwe3-16436220.pdf?src-supplier=Future+Electronics; ComponentLink5Description: https://datasheet.ciiva.com/16436/dcrcwe3-16436220.pdf?src-supplier=Future+Electronics; ComponentLink6URL: https://datasheet.ciiva.com/28634/1847332-28634462.pdf?src-supplier=Element14; ComponentLink6Description: https://datasheet.ciiva.com/28634/1847332-28634462.pdf?src-supplier=Element14; ComponentLink7URL: https://datasheet.ciiva.com/22665/1700795-22665689.pdf?src-supplier=Element14; ComponentLink7Description: https://datasheet.ciiva.com/22665/1700795-22665689.pdf?src-supplier=Element14; ComponentLink8URL: https://datasheet.ciiva.com/22870/70202042-22870476.pdf?src-supplier=Allied+Electronics; ComponentLink8Description: https://datasheet.ciiva.com/22870/70202042-22870476.pdf?src-supplier=Allied+Electronics; ComponentLink9URL: https://datasheet.ciiva.com/16777/70202042-16777655.pdf?src-supplier=Allied+Electronics; ComponentLink9Description: https://datasheet.ciiva.com/16777/70202042-16777655.pdf?src-supplier=Allied+Electronics; Supplier 1: Digikey; Supplier Part Number 1: 541-100KABCT-ND
TP900-TP910 = Test Point: Test pad, 0.90mm circular pad; PCB Footprint: testpad_0p90mm; Length (mm): 0.90; Manufacturer: N/A; Manufacturer PN: N/A; Medical Grade MFR: N/A; Medical Grade MFR PN: N/A; Rating: N/A; Thickness (mm): N/A; Value: Test point; Width (mm): 0.90; Category: Test point; Status: *; Review: *
U900 = DG4052EEN-T1-GE4: 2 Circuit IC Switch 4:1 78Ohm 16-miniQFN (1.8x2.6); Manufacturer Name: Vishay; Height: 0.6mm; Manufacturer Part Number: DG4052EEN-T1-GE4; Category: IC; Type: Switch; Supplier 1: Mouser; Supplier Part Number 1: 78-DG4052EEN-T1-GE4; Supplier 2: Digikey; Supplier Part Number 2: DG4052EEN-T1-GE4CT-ND; Supplier 3: Digikey; Supplier Part Number 3: DG4052EEN-T1-GE4DKR-ND; Supplier 4: Digikey; Supplier Part Number 4: DG4052EEN-T1-GE4TR-ND
U901 = DG4053EEN-T1-GE4: 2 Circuit IC Switch 4:1 78Ohm 16-miniQFN (1.8x2.6); Manufacturer Name: Vishay; Height: 0.6mm; Manufacturer Part Number: DG4053EEN-T1-GE4; Category: IC; Type: Switch; Supplier 1: Mouser; Supplier Part Number 1: 78-DG4053EEN-T1-GE4; Supplier 2: Digikey; Supplier Part Number 2: DG4053EEN-T1-GE4CT-ND; Supplier 3: Digikey; Supplier Part Number 3: DG4053EEN-T1-GE4DKR-ND; Supplier 4: Digikey; Supplier Part Number 4: DG4053EEN-T1-GE4TR-ND
U902 = TLV9002SIYCKR_B: Op Amp, Dual, Rail-to-Rail, 1MHz, BGA-9; Medical Grade MFR: TBD; Rating: 5.5V; Category: IC; Length (mm): 0.95 ±0.03; Medical Grade MFR PN: TBD; PCB Footprint: TBD; Thickness (mm): 0.33; Value: TLV9002SIYCKR; Width (mm): 0.95 ±0.03; Package Description: TBD; Supplier 1: Mouser; Supplier Part Number 1: 595-TLV9002SIYCKR; Status: *; Review: *; Manufacturer Part Number: TLV9002SIYCKR
U903 = AD8505ACBZ-R7: Op Amp, Rail-to-Rail, 95kHz, WLCSP-6; Medical Grade MFR: TBD; Rating: 5.5V; Category: IC; Length (mm): 1.39 ±0.04; Medical Grade MFR PN: TBD; PCB Footprint: TBD; Thickness (mm): 0.56 ±0.05; Width (mm): 0.90 ±0.04; Package Description: TBD; Supplier 1: Digi-Key; Supplier Part Number 1: AD8505ACBZ-R7CT-ND; Status: *; Review: *; Manufacturer Part Number: AD8505ACBZ-R7; Value: AD8505ACBZ-R7
U904 = AD8137YCPZ-REEL7: Differential Amplifier, 110 MHz, DFN-8; Manufacturer: Analog Devices; Medical Grade MFR: TBD; Category: IC; Length (mm): 3.00 ±0.10; Medical Grade MFR PN: TBD; Package Description: TBD; PCB Footprint: TBD; Rating: TBD; Thickness (mm): 0.75 ±0.05; Value: AD8137YCPZ-REEL7; Width (mm): 3.00 ±0.10; Supplier 1: Digi-Key; Supplier Part Number 1: 505-AD8137YCPZ-REEL7CT-ND; Status: *; Review: *; Manufacturer Part Number: AD8137YCPZ-REEL7
U905 U906 = DMC31D5UDJ-7: MOSFET N/P-CH 30V 0.22A SOT963; Manufacturer: Diodes inc.; Number of Channels: 2; Power Dissipation: 350mW; Id(Max): -200mA; Vgs(Max): ±12V; Vth(Max): -1.0V; Ron(Max): 4.5Ohm; Cin: 22.6pF; Manufacturer Part Number: DMC31D5UDJ-7; Category: Transistors; Type: MOSFET array; RoHs: RoHS 2; Package: SOT-963; Supplier 1: Digikey; Supplier Part Number 1: DMC31D5UDJ-7DICT-ND

## Sheet 08-MagnetSensor.SchDoc: Magnet Sensor
size A2; DocumentNumber: 8; SheetNumber: 8; SheetTotal: 15
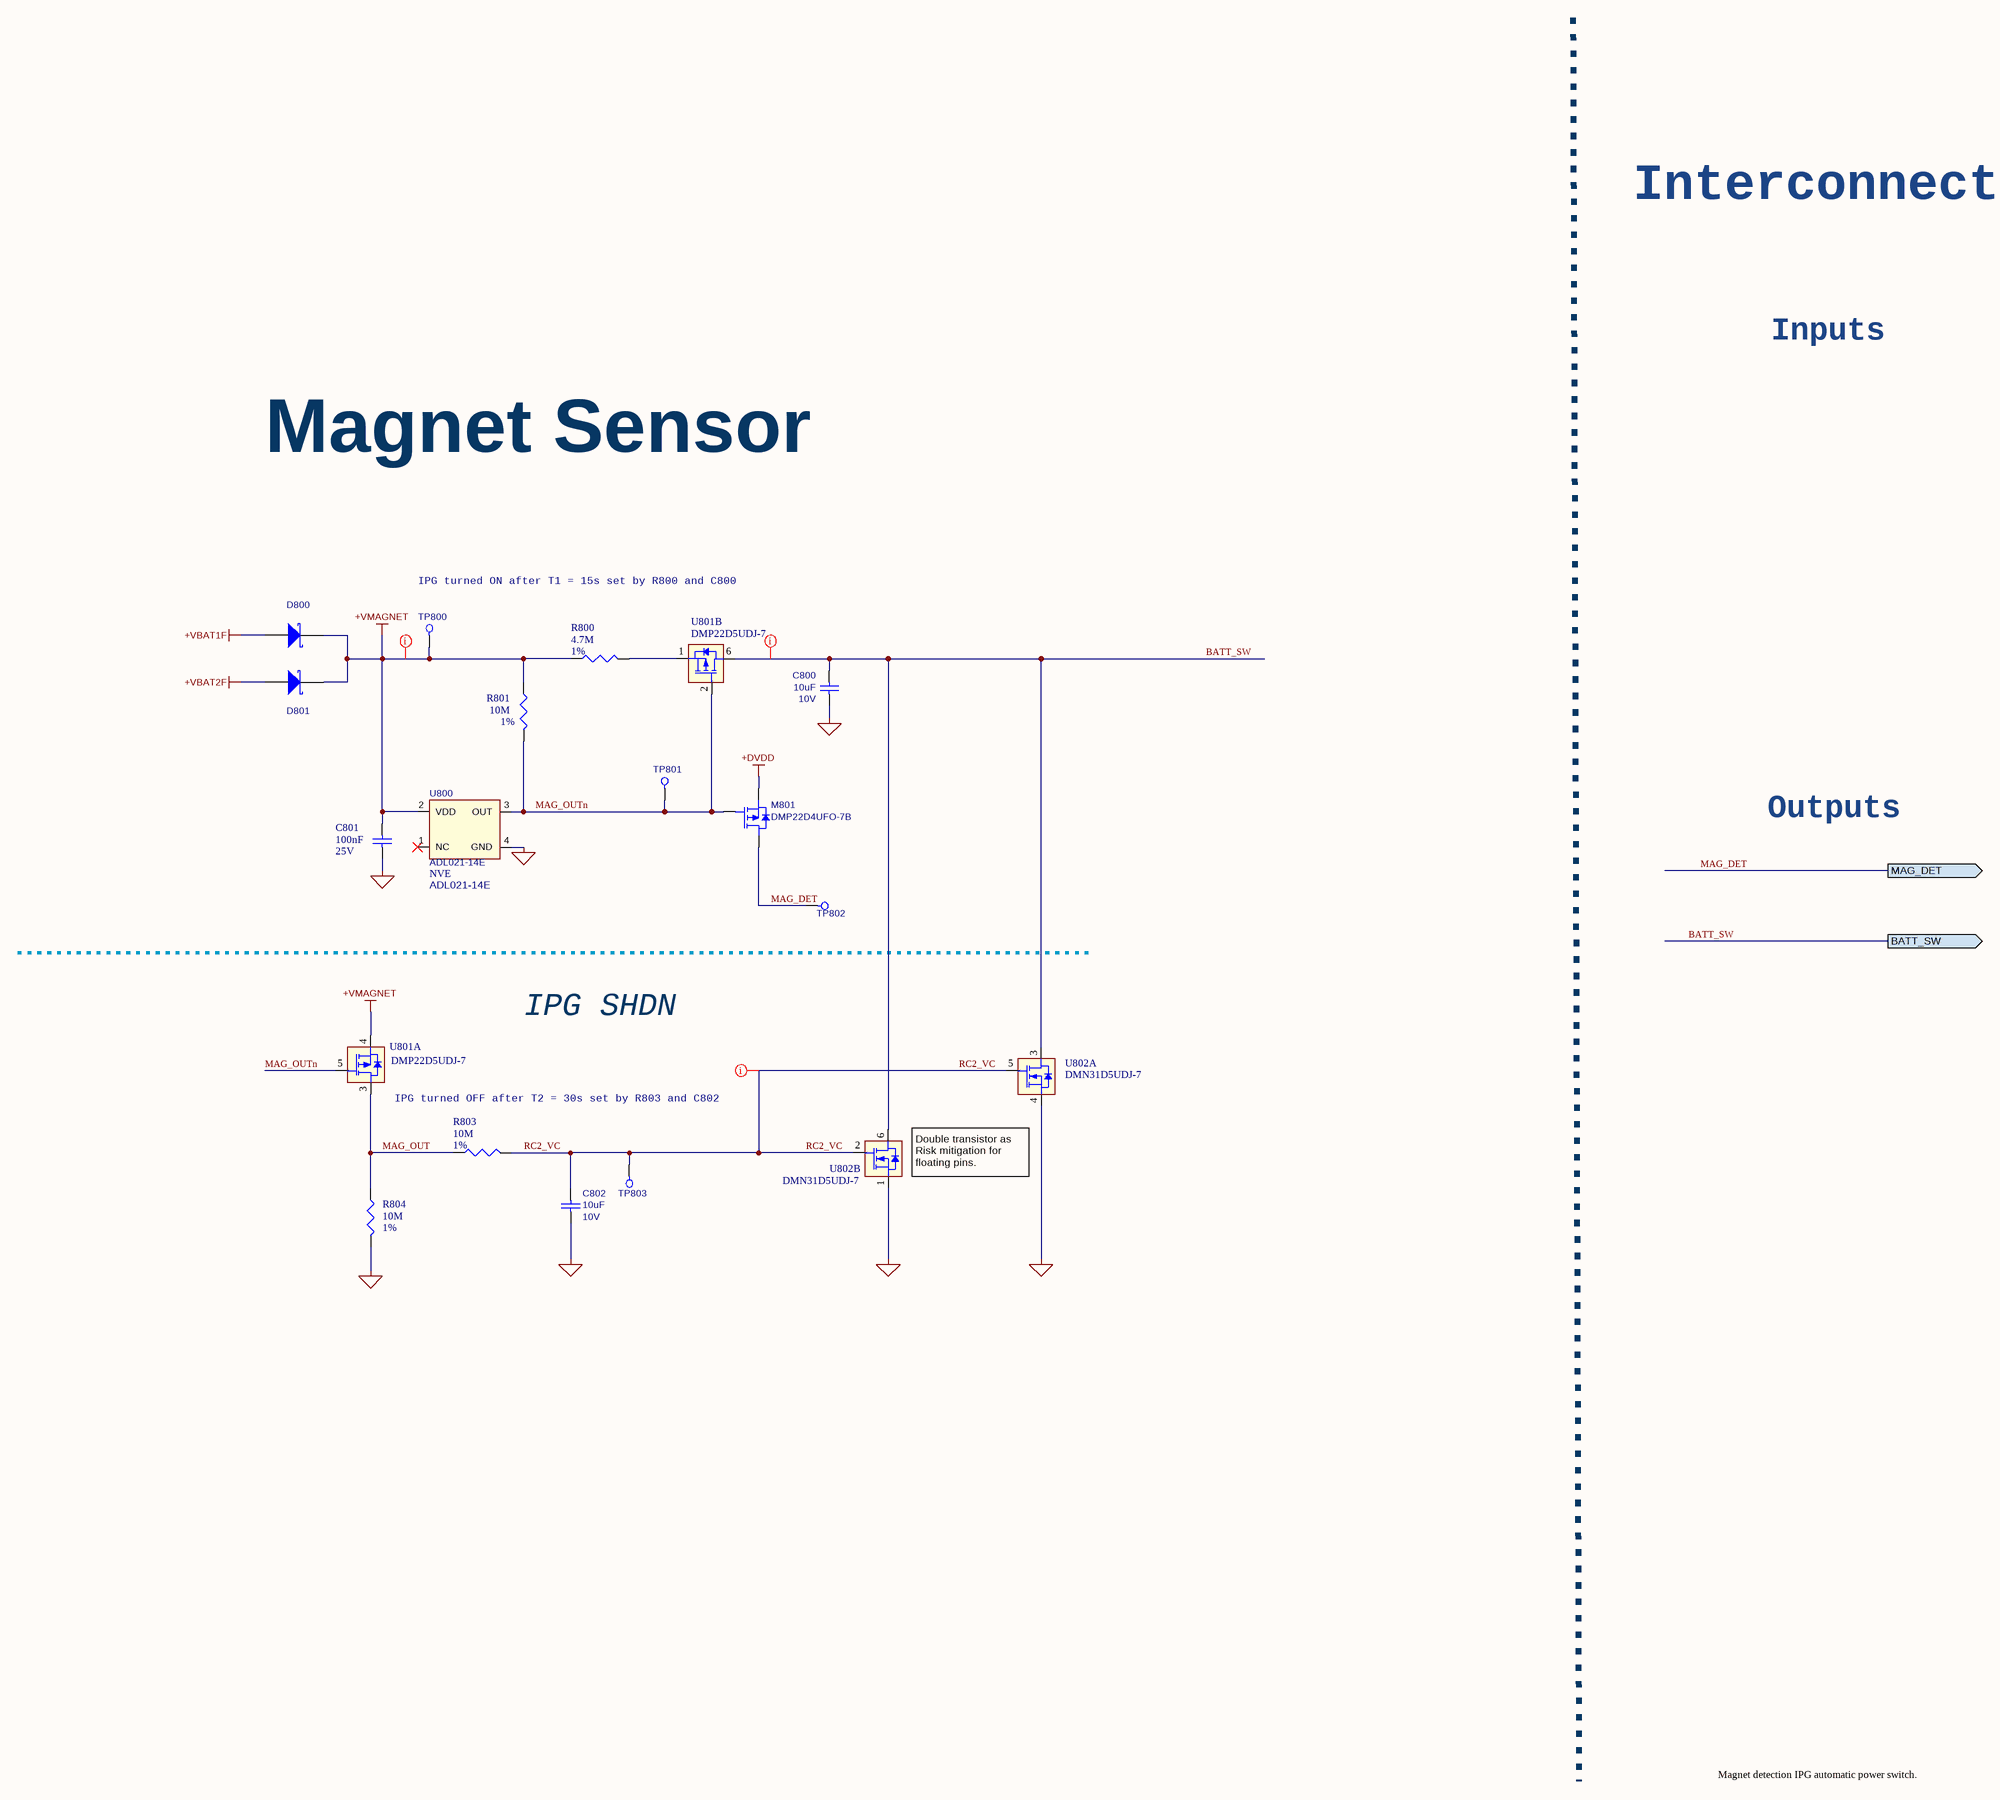
[diagram p14: 08-MagnetSensor.SchDoc]

### Parts
C800  value 10uF  Rating: 10V  [CAP0402_REDUCED]  (hidden comment: ZRB15XR61A106ME01D)
C801  value 100nF  Rated DC Voltage (URdc): 25V  [C0201_C]  (hidden comment: GRM033R61E104KE14J)
C802  value 10uF  Rating: 10V  [CAP0402_REDUCED]  (hidden comment: ZRB15XR61A106ME01D)
D800  NSR0130P2T5G  [ONSC_SOD-923_CASE514AB]  (value not drawn)
D801  NSR0130P2T5G  [ONSC_SOD-923_CASE514AB]  (value not drawn)
M801  DMP22D4UFO-7B  [DIODESINC_X2-DFN0604-3]
R800  value 4.7M  Tolerance: 1%  [R0201_C]  (hidden comment: CRCW02014M70FNED)
R801  value 10M  Tolerance: 1%  [R0201_C]  (hidden comment: CRCW020110M0FNED)
R803  value 10M  Tolerance: 1%  [R0201_C]  (hidden comment: CRCW020110M0FNED)
R804  value 10M  Tolerance: 1%  [R0201_C]  (hidden comment: CRCW020110M0FNED)
TP800  Test Point  [testpad_0.9mm]  (value not drawn)  (no BOM)
TP801  Test Point  [testpad_0.9mm]  (value not drawn)  (no BOM)
TP802  Test Point  [testpad_0.9mm]  (value not drawn)  (no BOM)
TP803  Test Point  [testpad_0.9mm]  (value not drawn)  (no BOM)
U800  ADL021-14E  Manufacturer: NVE  [NVE_ULLGA4]
U801  DMP22D5UDJ-7  [DIODESINC_SOT-963-6]  (parts A,B of 2)
U802  DMN31D5UDJ-7  [DIODESINC_SOT-963-6]  (parts A,B of 2)

### Ports
BATT_SW (out), MAG_DET (out)

### Nets
+DVDD: M801.2(S)
+VBAT1F: D800.2(A)
+VBAT2F: D801.2(A)
+VMAGNET: C801.2 D800.1(K) D801.1(K) R800.1 R801.1 TP800.1 U800.2(VDD) U801.4
GND: C800.2 C801.1 C802.1 R804.2 U800.4(GND) U802.1 U802.4
BATT_SW: C800.1 U801.6 U802.3 U802.6 ; port BATT_SW
MAG_DET: M801.3(D) TP802.1 ; port MAG_DET
MAG_OUT: R803.1 R804.1 U801.3
MAG_OUTn: M801.1(G) R801.2 TP801.1 U800.3(OUT) U801.2 U801.5
RC2_VC: C802.2 R803.2 TP803.1 U802.2 U802.5
NetR800_2: R800.2 U801.1

Not connected (* = marked no-connect by the designer): U800 1(NC)*

### Layout directives
net class ANALOG: BATT_SW, RC2_VC
Voltage: 2.8-4.2V; net class POWER: +VMAGNET

### Notes on the sheet
- Interconnect
- Inputs
- Magnet Sensor
- IPG turned ON after T1 = 15s set by R800 and C800
- Outputs
- IPG SHDN
- (near U801) IPG turned OFF after T2 = 30s set by R803 and C802
- (near U802) Double transistor as Risk mitigation for floating pins.
- Magnet detection IPG automatic power switch.
- Project:
- Schematic:
- Design by:
- Date:
- Ver:
- .
- Comments:
- Reviewed by:

### Library data of the parts
C800 C802 = ZRB15XR61A106ME01D: Capacitor, 10uf, X5R, 10V, 20%, 0402, Implant-grade; Manufacturer: Murata; Medical Grade MFR: TBD; Length (mm): 1.00 ±0.22; Medical Grade MFR PN: TBD; PCB Footprint: cap0402_reduced; Thickness (mm): 0.65 ±0.2; Width (mm): 0.50 ±0.2; Category: Capacitor; Package Description: 0402; Check: *; Status: *; Review: *; Manufacturer Part Number: ZRB15XR61A106ME01D
  C800: Supplier 1: Future Electronics; Supplier Part Number 1: 2114729
  C802: Supplier 1: Arrow Electronics; Supplier Part Number 1: ZRB15XR61A106ME01D
C801 = GRM033R61E104KE14J: as C900-C906 on sheet 09-IMC; Category: Ceramic Capacitors; Supplier: Digikey; Supplier Part Number: 490-14571-1-ND; Manufacturer Part Number: GRM033R61E104KE14J; RoHS: Yes; Stock: 1540851; Pricing: 1=0,1, 10=0,033, 50=0,0192, 100=0,0148, 500=0,01118, 1000=0,00878, 2500=0,00798, 5000=0,00734 (USD); Mounting Technology: Surface Mount; Pins: 2; Dielectric Material: Ceramic; Package Shape: Rectangular; Case/Package: 0201; Terminal Finish: Nickel; Min Operating Temperature: -55°C; Max Operating Temperature: 85°C; JESD-609 Code: e3; Capacitor Type: Ceramic; Tolerance  (fill in as +-): 10%; Package Style: SMTMeter; Packaging: Tape and Reel; Tolerance (fill in as +-): 10%; Temperature Characteristics Code: X5R; Termination: Wraparound; Length: 0.6mm; Width: 0.3mm; Height: 0.3mm; Reach SVHC Compliant: Yes; RoHS Compliant: Yes; ComponentLink1URL: https://psearch.en.murata.com:443/capacitor/product/GRM033R61E104KE14%23.pdf?src-supplier=IHS+Markit; ComponentLink1Description: https://psearch.en.murata.com:443/capacitor/product/GRM033R61E104KE14%23.pdf?src-supplier=IHS+Markit; ComponentLink2URL: http://www.mouser.com/ds/2/281/c02e-2905.pdf?src-supplier=Mouser; ComponentLink2Description: http://www.mouser.com/ds/2/281/c02e-2905.pdf?src-supplier=Mouser; ComponentLink3URL: http://search.murata.co.jp/Ceramy/image/img/A01X/G101/ENG/GRM033R61E104KE14-01.pdf?src-supplier=Digikey; ComponentLink3Description: http://search.murata.co.jp/Ceramy/image/img/A01X/G101/ENG/GRM033R61E104KE14-01.pdf?src-supplier=Digikey; ComponentLink4URL: https://search.murata.co.jp/Ceramy/image/img/A01X/G101/ENG/GRM033R61E104KE14-01.pdf?src-supplier=Digikey; ComponentLink4Description: https://search.murata.co.jp/Ceramy/image/img/A01X/G101/ENG/GRM033R61E104KE14-01.pdf?src-supplier=Digikey; Supplier 1: Arrow Electronics; Supplier Part Number 1: GRM033R61E104KE14J
D800 D801 = NSR0130P2T5G: Schottky, 30V, 100mA, 385mV, 200mW, SOD-923; Manufacturer: ON Semiconductor; Medical Grade MFR: TBD; Review: 020823; Length (mm): 1.00 ±0.05; Medical Grade MFR PN: TBD; PCB Footprint: TBD; Rating: 30V; Thickness (mm): 0.40 ±0.03; Value: NSR0130P2T5G; Width (mm): 0.60 ±0.05; Category: Diode; Supplier 1: Future Electronics; Supplier Part Number 1: 7098145; Status: Approved; Manufacturer Part Number: NSR0130P2T5G
M801 = DMP22D4UFO-7B: MOSFET, P-chan, -20V, -383mA, DFN0604; Manufacturer: Diodes Inc; Medical Grade MFR: TBD; Review: 020823; Category: Transistor; Length (mm): 0.60 ±0.05; Medical Grade MFR PN: TBD; Rating: -20V; Thickness (mm): 0.36 ±0.04; Width (mm): 0.40 ±0.05; Value: DMP22D4UFO-7B; PCB Footprint: TBD; Supplier 1: Digi-Key; Supplier Part Number 1: 31-DMP22D4UFO-7BCT-ND; Status: Approved; Manufacturer Part Number: DMP22D4UFO-7B
R800 = CRCW02014M70FNED: Fixed Resistor, Metal Glaze/thick Film, 0.05W, 4700000ohm, 30V, 1% +/-Tol, 200ppm/Cel, Surface Mount, 0201; Manufacturer: Vishay Dale; Medical Grade MFR: TBD; Manufacturer Series: CRCW0201E3; Power: 50mW; Rated Temperature: 70°C; Temperature Coefficient: 200ppm/°C; Category: Chip SMD Resistors; Supplier: Digikey; Supplier Part Number: 541-CRCW02015M10FNEDCT-ND; Manufacturer Part Number: CRCW02014M70FNED; RoHS: Yes; Stock: 56300; Pricing: 1=0,1, 10=0,037, 50=0,0242, 100=0,0204, 500=0,01426, 1000=0,01241, 5000=0,00924 (USD); Mounting Technology: Surface Mount; Pins: 2; Package Shape: Rectangular; Case/Package: 0201; Terminal Finish: Nickel; Min Operating Temperature: -55°C; Max Operating Temperature: 155°C; JESD-609 Code: e3; Resistor Type: FIXED RESISTOR; Packaging: Tape and Reel; Technology: METAL GLAZE/THICK FILM; Termination: Wraparound; Working Voltage: 30V; Reach SVHC Compliant: Yes; RoHS Compliant: Yes; ComponentLink1URL: https://datasheet.ciiva.com:443/pdfs/VipMasterIC/IC/VISH/VISH-S-A0002932828/VISH-S-A0002932828-1.pdf?src-supplier=IHS+Markit; ComponentLink1Description: https://datasheet.ciiva.com:443/pdfs/VipMasterIC/IC/VISH/VISH-S-A0002932828/VISH-S-A0002932828-1.pdf?src-supplier=IHS+Markit; ComponentLink2URL: https://datasheet.ciiva.com/7843/1719906-7843192.pdf?src-supplier=Element14; ComponentLink2Description: https://datasheet.ciiva.com/7843/1719906-7843192.pdf?src-supplier=Element14; ComponentLink3URL: https://datasheet.ciiva.com/7843/1719906-7843193.pdf?src-supplier=Element14; ComponentLink3Description: https://datasheet.ciiva.com/7843/1719906-7843193.pdf?src-supplier=Element14; ComponentLink4URL: https://datasheet.ciiva.com/6073/1719906-6073775.pdf?src-supplier=Farnell; ComponentLink4Description: https://datasheet.ciiva.com/6073/1719906-6073775.pdf?src-supplier=Farnell; Medical Grade MFR PN: TBD; Supplier 1: Digikey; Supplier Part Number 1: 541-CRCW02014M70FNEDCT-ND
R801 R803 R804 = CRCW020110M0FNED: as R903 on sheet 09-IMC; Category: Chip SMD Resistors; Supplier: Mouser; Supplier Part Number: 71-CRCW020110M0FNED; Manufacturer Part Number: CRCW020110M0FNED; RoHS: Yes; Stock: 159754; Pricing: 1=0,1, 10=0,024, 50=0,024, 100=0,014, 1000=0,011, 10000=0,006 (USD); Mounting Technology: Surface Mount; Pins: 2; Package Shape: Rectangular; Case/Package: 0201; Terminal Finish: Nickel; Min Operating Temperature: -55°C; Max Operating Temperature: 155°C; JESD-609 Code: e3; Resistor Type: FIXED RESISTOR; Packaging: Tape and Reel; Technology: METAL GLAZE/THICK FILM; Termination: Wraparound; Working Voltage: 30V; Reach SVHC Compliant: Yes; RoHS Compliant: Yes; ComponentLink1URL: https://datasheet.ciiva.com:443/pdfs/VipMasterIC/IC/VISH/VISH-S-A0002932828/VISH-S-A0002932828-1.pdf?src-supplier=IHS+Markit; ComponentLink1Description: https://datasheet.ciiva.com:443/pdfs/VipMasterIC/IC/VISH/VISH-S-A0002932828/VISH-S-A0002932828-1.pdf?src-supplier=IHS+Markit; ComponentLink2URL: https://datasheet.ciiva.com/7673/1719906-7673177.pdf?src-supplier=Element14; ComponentLink2Description: https://datasheet.ciiva.com/7673/1719906-7673177.pdf?src-supplier=Element14; ComponentLink3URL: https://datasheet.ciiva.com/7673/1719906-7673178.pdf?src-supplier=Element14; ComponentLink3Description: https://datasheet.ciiva.com/7673/1719906-7673178.pdf?src-supplier=Element14; ComponentLink4URL: https://datasheet.ciiva.com/22692/1719906-22692711.pdf?src-supplier=Element14; ComponentLink4Description: https://datasheet.ciiva.com/22692/1719906-22692711.pdf?src-supplier=Element14; ComponentLink5URL: https://datasheet.ciiva.com/22665/1700795-22665701.pdf?src-supplier=Element14; ComponentLink5Description: https://datasheet.ciiva.com/22665/1700795-22665701.pdf?src-supplier=Element14; Supplier 1: Digikey; Supplier Part Number 1: 541-CRCW020110M0FNEDCT-ND
TP800-TP803 = Test Point: as TP900-TP910 on sheet 09-IMC; Length (mm): 0.90; Manufacturer: N/A; Manufacturer PN: N/A; Medical Grade MFR: N/A; Medical Grade MFR PN: N/A; Rating: N/A; Thickness (mm): N/A; Value: Test point; Width (mm): 0.90; Category: Test point; Status: *; Review: *
U800 = ADL021-14E: Magnet Sensor, 15 Gauss, ULLGA4, Implant-grade; Medical Grade MFR PN: BD020-14E; PCB Footprint: TBD; Length (mm): 1.10; Medical Grade MFR: NVE; Rating: N/A; Thickness (mm): 0.40; Value: ADL021-14E; Width (mm): 1.10; Category: IC; Package Description: TBD; Supplier 1: Digi-Key; Supplier Part Number 1: 391-ADL021-14ECT-ND; Status: *; Review: *; Manufacturer Part Number: ADL021-14E
U801 = DMP22D5UDJ-7: MOSFET 2P-CH 20V 0.36A SOT963; Manufacturer: Diodes inc.; Number of Channels: 2; Power Dissipation: 380mW; Id(Max): -360mA; Vds(Max): -20V; Vgs(Max): ±8V; Vth(Max): -1.0V; Ron(Max): 5Ohm; Cin: 17pF; Manufacturer Part Number: DMP22D5UDJ-7; Category: Transistors; Type: MOSFET array; RoHs: RoHS 2; Package: SOT-963; Supplier 1: Digikey; Supplier Part Number 1: 31-DMP22D5UDJ-7DKR-ND
U802 = DMN31D5UDJ-7: MOSFET 2N-CH 30V 0.22A SOT963; Manufacturer: Diodes inc.; Number of Channels: 2; Power Dissipation: 350mW; Id(Max): 220mA; Vgs(Max): ±12V; Vth(Max): 1.0V; Ron(Max): 4.5Ohm; Cin: 22.6pF; Manufacturer Part Number: DMN31D5UDJ-7; Category: Transistors; Vds(Max): 30V; Type: MOSFET array; RoHs: RoHS 2; Package: SOT-963; Supplier 1: Digikey; Supplier Part Number 1: 31-DMN31D5UDJ-7CT-ND